# EAGLE design RasPiTimePowerSWv.1.5 (EAGLE 8.2.2)
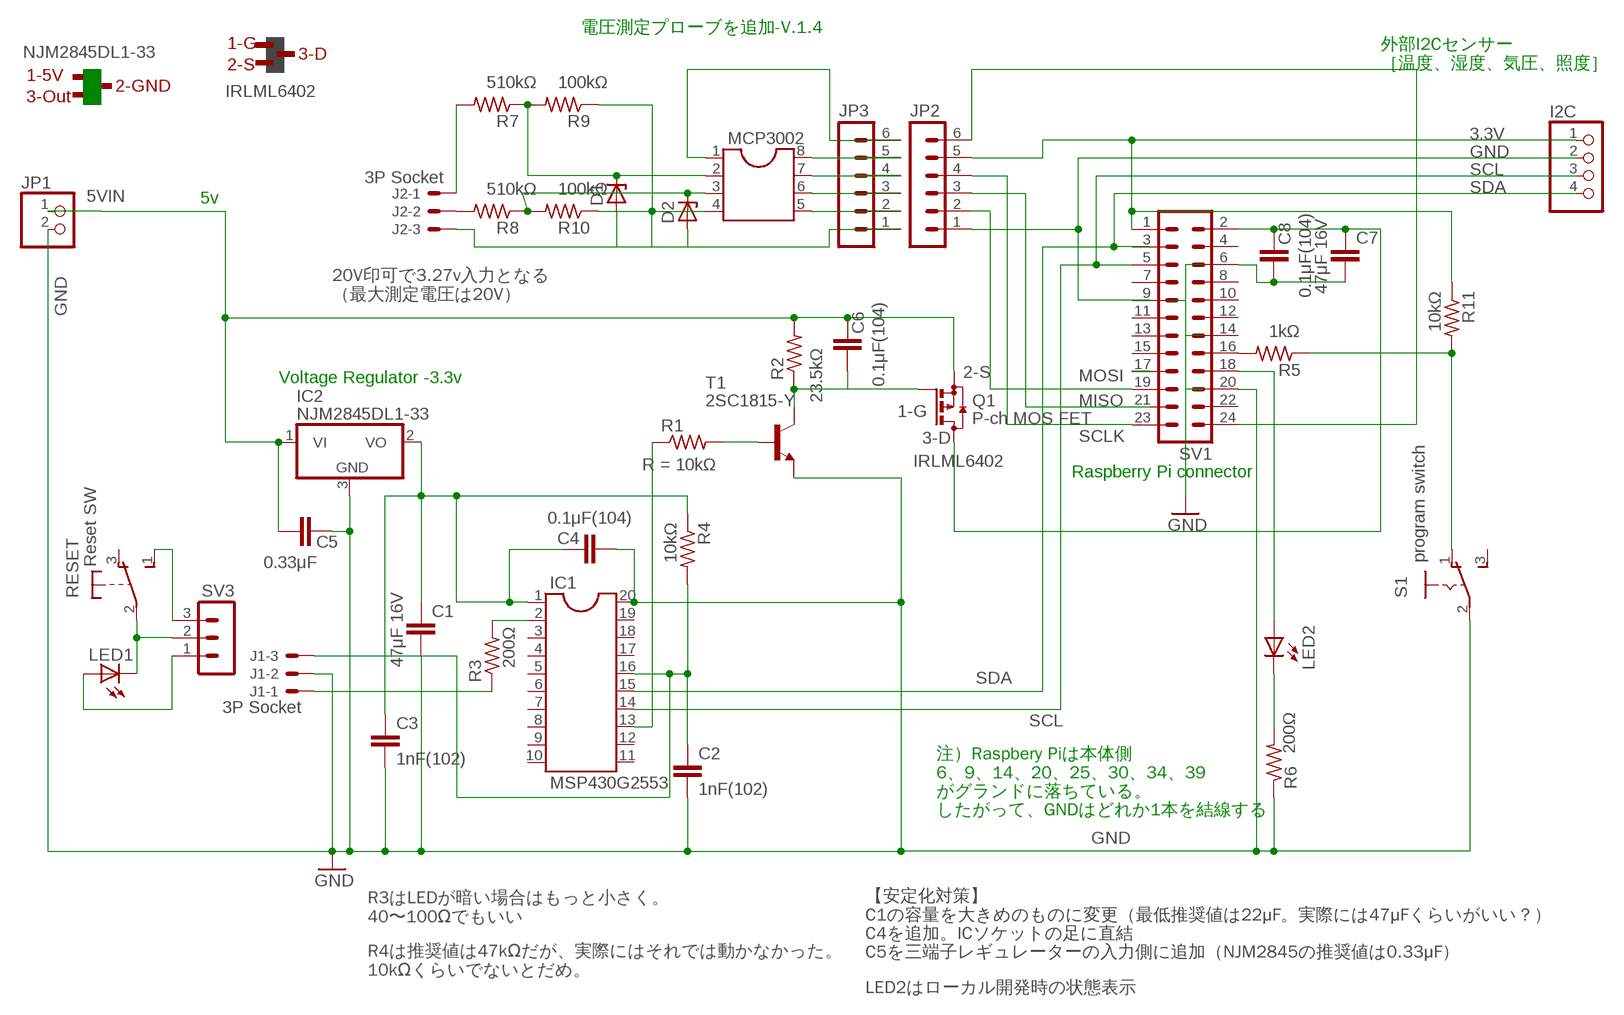
[diagram p0: schematic, sheet 1]

## Parts
C1  47μF 16V  C-EU075-042X103  [C075-042X103]
C2  1nF(102)  C-EU025-024X044  [C025-024X044]
C3  1nF(102)  C-EU025-024X044  [C025-024X044]
C4  0.1μF(104)  C-EU025-024X044  [C025-024X044]
C5  0.33μF  C-EU025-024X044  [C025-024X044]
C6  0.1μF(104)  C-EU025-024X044  [C025-024X044]
C7  47μF 16V  C-EU075-042X103  [C075-042X103]
C8  0.1μF(104)  C-EU025-024X044  [C025-024X044]
D1  ZENER-DIODEDO34-7  [DO34Z7]
D2  ZENER-DIODEDO34-7  [DO34Z7]
I2C  PINHD-1X4  [1X04]
IC1  MSP430G2553  DIL20S  [SOCKET-20]
IC2  NJM2845DL1-33  7818DT  [TO252]
J1  3P Socket  22-27-2031-03  [6410-03]
J2  3P Socket  22-27-2031-03  [6410-03]
JP1  PINHD-1X2  [1X02]
JP2  MA06-1  [MA06-1]
JP3  MA06-1  [MA06-1]
LED1  TLLG4400  [LED3MM]
LED2  TLLG4400  [LED3MM]
MCP3002  DIL8  [DIL08]
Q1  P-ch MOS FET  BSS84  [SOT23]
R1  R-US_MELF0102W  [MINI_MELF-0102W]
R2  R-US_MELF0102W  [MINI_MELF-0102W]
R3  R-US_MELF0102W  [MINI_MELF-0102W]
R4  10kΩ  R-US_MELF0102W  [MINI_MELF-0102W]
R5  R-US_MELF0102W  [MINI_MELF-0102W]
R6  R-US_MELF0102W  [MINI_MELF-0102W]
R7  R-US_MELF0102W  [MINI_MELF-0102W]
R8  R-US_MELF0102W  [MINI_MELF-0102W]
R9  R-US_MELF0102W  [MINI_MELF-0102W]
R10  R-US_MELF0102W  [MINI_MELF-0102W]
R11  10kΩ  R-US_MELF0102W  [MINI_MELF-0102W]
RESET  Reset SW  9450-1  [9450-1]
S1  program switch  255SB  [255SB]
SV1  MA12-2  [MA12-2]
SV3  MA03-1  [MA03-1]
T1  2SC1815-Y  2SC1815  [TO92-ECB]

## Nets
3.3V: C1.1 C3.1 C4.1 I2C.1 IC1.1 IC2.2(VO) JP2.5 R4.1 R11.1 SV1.1
5V: C7.1 C8.1 Q1.3(D) SV1.2
5VIN: C5.2 C6.1 IC2.1(VI) JP1.1 Q1.2(S) R2.2
GND: C1.2 C2.2 C3.2 C4.2 C5.1 I2C.2 IC1.20 IC2.3(GND) J1.2 JP1.2 JP2.1 R6.1 S1.2(P) SV1.9 SV1.20 T1.E
MISO: JP2.3 SV1.21
MOSI: JP2.2 SV1.19
N$1: R1.2 T1.B
N$2: IC1.13 R1.1
N$3: R5.2 SV1.16
N$4: IC1.2 R3.2
N$5: R5.1 R11.2 S1.1(O)
N$6: C6.2 Q1.1(G) R2.1 T1.C
N$7: J2.2 R8.2
N$8: C7.2 C8.2 SV1.6
N$9: LED2.A SV1.18
N$10: LED2.K(C) R6.2
N$11: RESET.1(S) SV3.3
N$12: LED1.A SV3.1
N$13: SV1.17
N$14: JP2.6 SV1.24
N$15: D1.C MCP3002.2 R7.1 R9.2
N$16: D2.C MCP3002.3 R8.1 R10.2
N$18: J2.1 R7.2
N$19: JP3.6 MCP3002.1
N$20: D1.A D2.A J2.3 JP3.1 MCP3002.4 R9.1 R10.1
N$21: JP3.2 MCP3002.5
N$22: JP3.3 MCP3002.6
N$23: JP3.4 MCP3002.7
N$24: JP3.5 MCP3002.8
N$25: LED1.K(C) RESET.2(P) SV3.2
N$26: J1.1 R3.1
RESET: C2.1 IC1.16 J1.3 R4.2
SCL: I2C.3 IC1.14 SV1.5
SCLK: JP2.4 SV1.23
SDA: I2C.4 IC1.15 SV1.3
Unconnected: IC1.3 IC1.4 IC1.5 IC1.6 IC1.7 IC1.8 IC1.9 IC1.10 IC1.11 IC1.12 IC1.17 IC1.18 IC1.19 RESET.3(O) S1.3(S) SV1.4 SV1.7 SV1.8 SV1.10 SV1.11 SV1.12 SV1.13 SV1.14 SV1.15 SV1.22

## Notes on the sheet
- 電圧測定プローブを追加-V.1.4
- 1-G
- NJM2845DL1-33 | 3-D
- 外部I2Cセンサー
  ［温度、湿度、気圧、照度］
- 2-S
- 1-5V
- 2-GND
- IRLML6402
- 3-Out
- 5v
- 20V印可で3.27v入力となる
  （最大測定電圧は20V）
- 2-S
- Voltage Regulator -3.3v
- 1-G
- 3-D
- IRLML6402
- Raspberry Pi connector
- 注）Raspbery Piは本体側
  6、9、14、20、25、30、34、39
  がグランドに落ちている。
  したがって、GNDはどれか1本を結線する
- R3はLEDが暗い場合はもっと小さく。
  40〜100Ωでもいい
- 【安定化対策】
  C1の容量を大きめのものに変更（最低推奨値は22μF。実際には47μFくらいがいい？）
  C4を追加。ICソケットの足に直結
  C5を三端子レギュレーターの入力側に追加（NJM2845の推奨値は0.33μF）
- R4は推奨値は47kΩだが、実際にはそれでは動かなかった。
  10kΩくらいでないとだめ。
- LED2はローカル開発時の状態表示

## Library data of the parts
C1-C8 = resistor:C-EU: CAPACITOR, European symbol
D1 D2 = diode:ZENER-DIODE: Z-Diode
I2C = pinhead:PINHD-1X4: PIN HEADER
IC1 = ic-package:DIL20: Dual In Line / Socket
IC2 = linear:78*: Positive VOLTAGE REGULATOR Source: http://cache.national.com/ds/LM/LM78L05.pdf http://www.fairchildsemi.com/ds/LM/LM7805.pdf
J1 J2 = con-molex:22-?-03: CONNECTOR wire to board 2.54 mm (.1 inch) pitch header; OC_FARNELL: unknown; OC_NEWARK: unknown
JP1 = pinhead:PINHD-1X2: PIN HEADER
JP2 JP3 = con-lstb:MA06-1: PIN HEADER; OC_FARNELL: unknown; OC_NEWARK: unknown
LED1 LED2 = led:TLLG4400: Low Current (2mA) LED 3 mm Tinted Diffused Package color GREEN Source: Data sheet <http://www.farnell.com/datasheets/391098.pdf>; MF: VISHAY SEMICONDUCTOR; OC_FARNELL: 1612435
MCP3002 = ic-package:DIL8: Dual In Line / Socket
Q1 = transistor-small-signal:BSS84: P-CHANNEL MOS FET
R1 = resistor:R-US_: RESISTOR, American symbol; R: 10kΩ
R2 = resistor:R-US_: RESISTOR, American symbol; 1K: 23.5kΩ
R3 R6 = resistor:R-US_: RESISTOR, American symbol; R: 200Ω
R4 R11 = resistor:R-US_: RESISTOR, American symbol
R5 = resistor:R-US_: RESISTOR, American symbol; 1K: 1kΩ
R7 R8 = resistor:R-US_: RESISTOR, American symbol; 1K: 510kΩ
R9 R10 = resistor:R-US_: RESISTOR, American symbol; 1K: 100kΩ
RESET = switch-misc:9450-1: MARQUARDT SWITCH
S1 = switch:255SB: SLIDING SWITCH Distributor Buerklin, 11G810
SV1 = con-lstb:MA12-2: PIN HEADER; OC_FARNELL: unknown; OC_NEWARK: unknown
SV3 = con-lstb:MA03-1: PIN HEADER; OC_FARNELL: unknown; OC_NEWARK: unknown
T1 = transistor:2SC1815: NPN EPITAXIAL TRANSISTOR Source: TOSHIBA .. 2SC1815 1.pdf

## Board
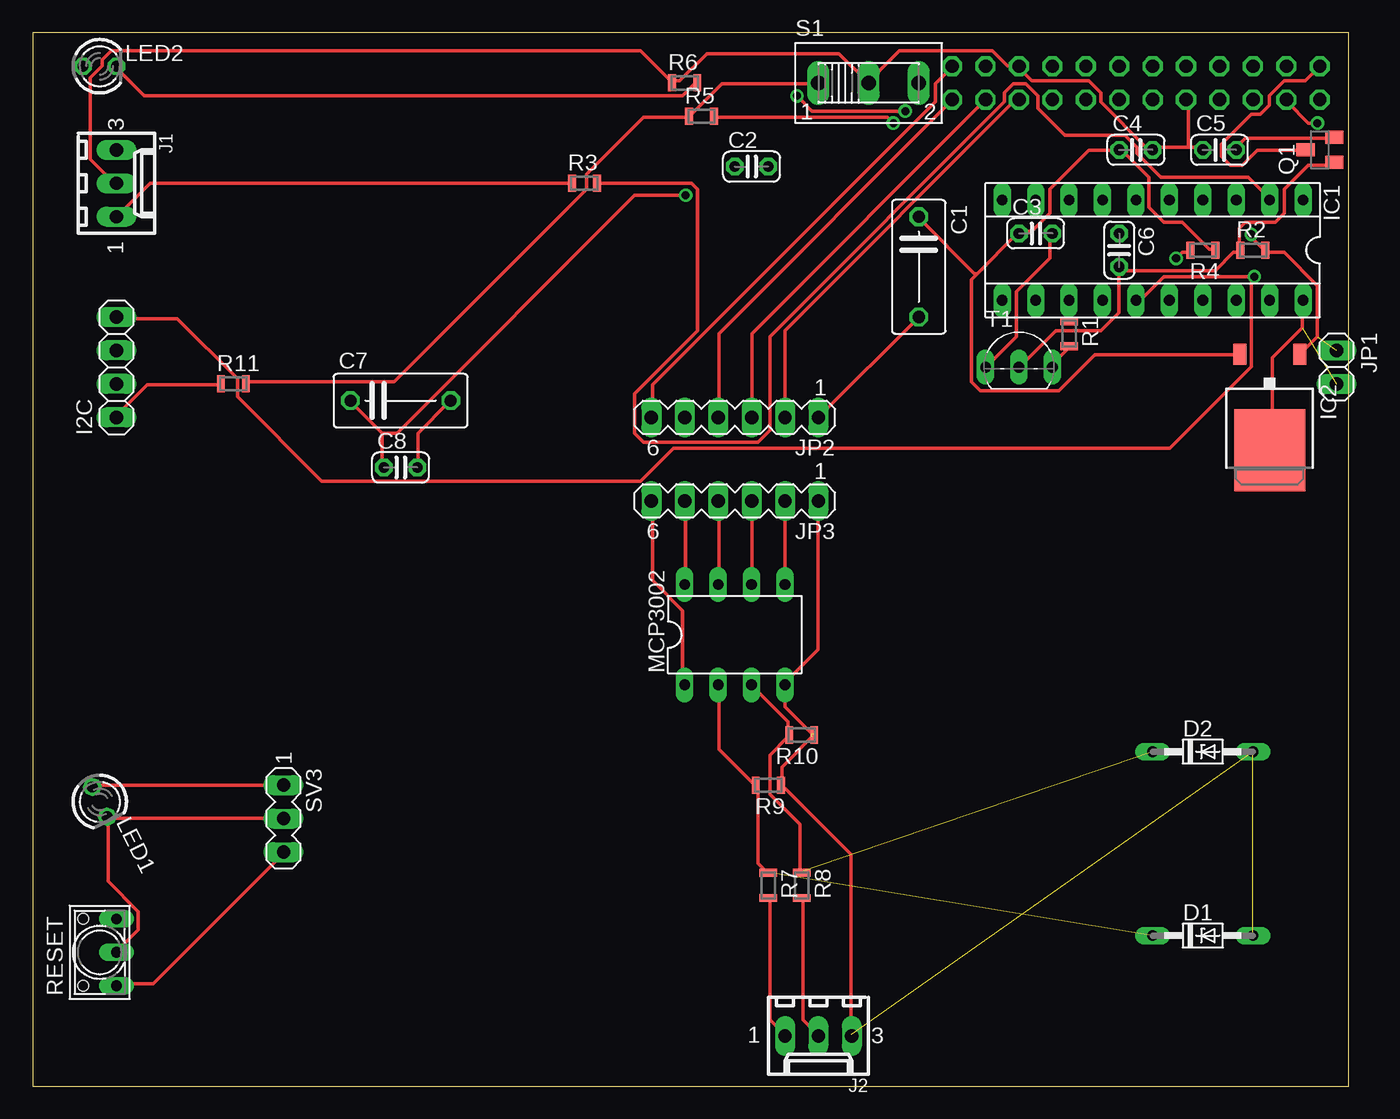
[diagram p1: board, top side]
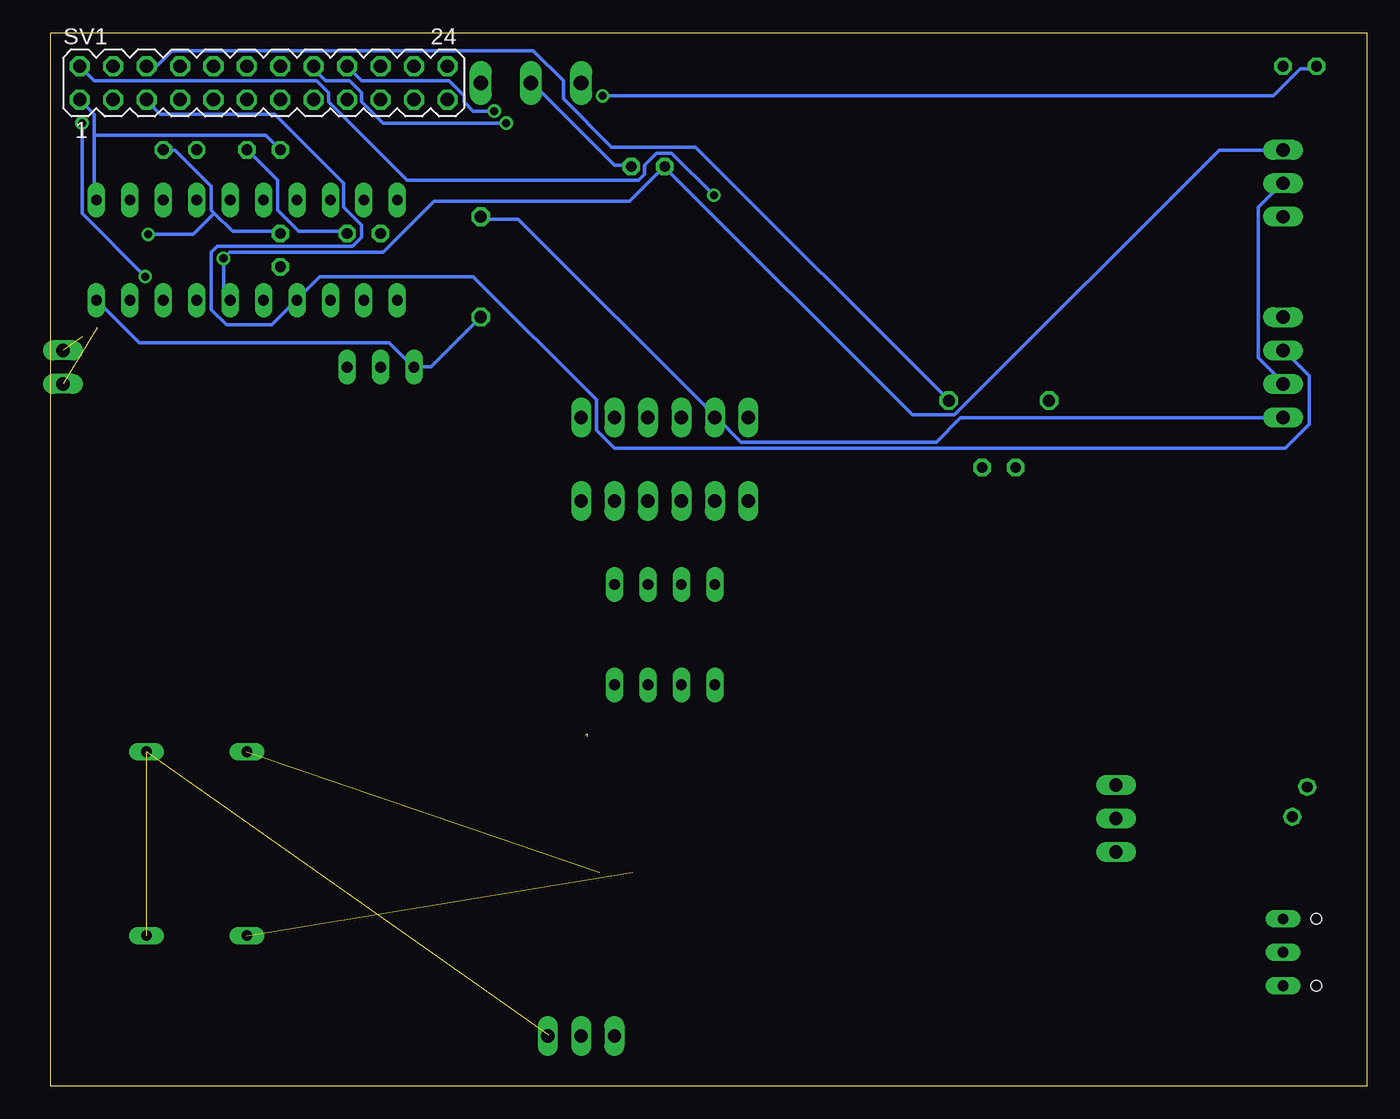
[diagram p2: board, bottom side, seen from below]

Size 100 x 80 mm. Coordinates in mm from the lower left corner, seen from the top.
Outline: 0,0 100,0 100,80 0,80 0,0
Copper layers (1*16): Top 0.035mm / dielectric 1.5mm / Bottom 0.035mm
Design rules "default": minimum track width 10mil, minimum drill 24mil, track to track 8mil, track to pad 8mil, pad to pad 8mil, via to via 8mil, smd to smd 8mil, copper to edge 40mil, drill to drill 8mil, minimum pad ring 10mil, minimum via ring 8mil, stop-mask expansion 4mil, vias tented up to drill 0mil, thermal gap 10mil

### Footprints (pad centres in the part's own frame; a part is rotated, then mirrored left to right if it is on the bottom)
C075-042X103 = drill 0.914 octagon: 1 -3.81,0; 2 3.81,0
C025-024X044 = drill 0.813 octagon: 1 -1.27,0; 2 1.27,0
DO34Z7 = drill 0.813 long: A 3.81,0; C -3.81,0
1X04 = drill 1.016 long: 1 -3.81,0; 2 -1.27,0; 3 1.27,0; 4 3.81,0
SOCKET-20 = drill 0.813 long: 1 -11.43,-3.81; 2 -8.89,-3.81; 3 -6.35,-3.81; 4 -3.81,-3.81; 5 -1.27,-3.81; 6 1.27,-3.81; 7 3.81,-3.81; 8 6.35,-3.81; 9 8.89,-3.81; 10 11.43,-3.81; 11 11.43,3.81; 12 8.89,3.81; 13 6.35,3.81; 14 3.81,3.81; 15 1.27,3.81; 16 -1.27,3.81; 17 -3.81,3.81; 18 -6.35,3.81; 19 -8.89,3.81; 20 -11.43,3.81
TO252 = smd 1 x 1.6: 1 -2.28,-4.8; 2 2.28,-4.8 | smd 5.4 x 6.2: 3 0,2.5
6410-03 = drill 1.016 long: 1 2.54,0; 2 0,0; 3 -2.54,0
1X02 = drill 1.016 long: 1 -1.27,0; 2 1.27,0
MA06-1 = drill 1.016 long: 1 -6.35,0; 2 -3.81,0; 3 -1.27,0; 4 1.27,0; 5 3.81,0; 6 6.35,0
LED3MM = drill 0.813 octagon: A -1.27,0; K 1.27,0
DIL08 = drill 0.813 long: 1 -3.81,-3.81; 2 -1.27,-3.81; 3 1.27,-3.81; 4 3.81,-3.81; 5 3.81,3.81; 6 1.27,3.81; 7 -1.27,3.81; 8 -3.81,3.81
SOT23 = smd 1 x 1.4: 1 -0.95,-1.1; 2 0.95,-1.1; 3 0,1.1
MINI_MELF-0102W = smd 0.6 x 1.3: 1 -0.95,0; 2 0.95,0
9450-1 = drill 0.813 long: 1 -2.54,-1.27; 2 0,-1.27; 3 2.54,-1.27 | hole 0.813: 2.54,1.27; -2.54,1.27
255SB = drill 1.118 long: 1 -3.81,0; 2 0,0; 3 3.81,0
MA12-2 = drill 1.016 octagon: 1 -13.97,-1.27; 2 -13.97,1.27; 3 -11.43,-1.27; 4 -11.43,1.27; 5 -8.89,-1.27; 6 -8.89,1.27; 7 -6.35,-1.27; 8 -6.35,1.27; 9 -3.81,-1.27; 10 -3.81,1.27; 11 -1.27,-1.27; 12 -1.27,1.27; 13 1.27,-1.27; 14 1.27,1.27; 15 3.81,-1.27; 16 3.81,1.27; 17 6.35,-1.27; 18 6.35,1.27; 19 8.89,-1.27; 20 8.89,1.27; 21 11.43,-1.27; 22 11.43,1.27; 23 13.97,-1.27; 24 13.97,1.27
MA03-1 = drill 1.016 long: 1 -2.54,0; 2 0,0; 3 2.54,0
TO92-ECB = drill 0.813 long: B 2.54,0; C 0,0; E -2.54,0

### Placement (x,y rotation side)
C1  67.31,62.23 270 top
C2  54.61,69.85 0 top
C3  76.2,64.77 0 top
C4  83.82,71.12 0 top
C5  90.17,71.12 0 top
C6  82.55,63.5 270 top
C7  27.94,52.07 0 top
C8  27.94,46.99 0 top
D1  88.9,11.43 0 top
D2  88.9,25.4 0 top
I2C  6.35,54.61 90 top
IC1  85.09,63.5 180 top
IC2  93.98,50.8 180 top
J1  6.35,68.58 270 top
J2  59.69,3.81 180 top
JP1  99.06,54.61 270 top
JP2  53.34,50.8 180 top
JP3  53.34,44.45 180 top
LED1  5.08,21.59 296.5 top
LED2  5.08,77.47 0 top
MCP3002  53.34,34.29 0 top
Q1  97.79,71.12 90 top
R1  78.74,57.15 270 top
R2  92.71,63.5 0 top
R3  41.91,68.58 0 top
R4  88.9,63.5 180 top
R5  50.8,73.66 0 top
R6  49.53,76.2 0 top
R7  55.88,15.24 270 top
R8  58.42,15.24 270 top
R9  55.88,22.86 180 top
R10  58.42,26.67 180 top
R11  15.24,53.34 0 top
RESET  5.08,10.16 90 top
S1  63.5,76.2 0 top
SV1  83.82,76.2 0 bottom
SV3  19.05,20.32 270 top
T1  74.93,54.61 0 top

### Tracks (layer width: path | path; a pad name or v marks a point on that pad's centre or on a via)
3.3V
  Top 0.254: R4.1 89.84,63.55 89.38,63.55 87.33,65.61 85.95,65.61 84.81,66.75 84.81,69.04 82.75,71.09 C4.1 82.53,71.09 80.24,71.09 77.27,68.12 77.27,66.29 75.89,64.92 74.98,64.92 C3.1 74.75,64.69 71.78,61.72 | R11.1 14.17,53.26 8.69,53.26 6.4,50.98 I2C.1 | 71.78,61.72 71.32,61.27 71.32,53.49 72.01,52.81 77.95,52.81 80.7,55.55 91.67,55.55 IC2.2 | 71.78,61.72 71.55,61.72 67.44,65.84 C1.1
  Bottom 0.254: 96.7,72.24 96.7,73.84 SV1.1 | 96.7,72.24 96.7,67.44 IC1.1 | 96.7,72.24 83.67,72.24 C4.1 | C1.1 67.21,65.84 64.47,65.84 49.61,50.98 JP2.5 49.38,50.75 47.55,48.92 32.69,48.92 30.86,50.75 6.4,50.75 I2C.1
5V  (via drill 0.61)
  Top 0.254: 26.52,49.61 26.52,47.09 C8.1 | 26.52,49.61 24.23,51.89 C7.1 | Q1.3 96.47,71.09 93.04,71.09 91.9,69.95 90.98,69.95 90.3,70.64 90.3,71.55 92.58,73.84 93.27,73.84 93.95,74.52 93.95,75.21 95.1,76.35 96.7,76.35 97.61,77.27 SV1.2 | 26.52,49.61 27.66,49.61 45.72,67.67 v49.61,67.67
  Bottom 0.254: v49.61,67.67 52.81,70.87 53.95,70.87 54.86,69.95 54.86,69.27 55.32,68.81 72.92,68.81 78.87,74.75 78.87,75.44 79.78,76.35 96.7,76.35 97.61,77.27 SV1.2
5VIN  (via drill 0.61)  (1 unrouted)
  Top 0.254: IC2.1 96.47,55.78 97.61,56.92 97.61,60.81 95.1,63.32 93.73,63.32 R2.2 93.5,63.55 92.58,64.47 v92.58,64.69 | Q1.2 98.75,72.01 92.13,72.01 91.44,71.32 C5.2
  Bottom 0.254: 87.55,66.29 87.78,66.52 87.78,68.35 90.53,71.09 91.44,71.09 C5.2 | 87.55,66.29 86.18,64.92 82.75,64.92 C6.1 | v92.58,64.69 89.15,64.69 87.55,66.29
GND  (1 unrouted)
  Top 0.254: 87.78,71.32 85.27,71.32 C4.2 85.04,71.32 84.58,71.32 81.15,74.75 81.15,75.44 80.24,76.35 75.89,76.35 74.98,77.27 SV1.20 74.75,77.5 74.07,77.5 72.92,78.64 65.84,78.64 63.55,76.35 S1.2 63.32,76.35 61.27,78.41 51.21,78.41 49.15,76.35 48.69,76.35 R6.1 48.46,76.35 46.18,78.64 5.94,78.64 5.26,77.95 5.26,77.5 4.34,76.58 4.34,70.41 6.17,68.58 J1.2 | 87.78,71.32 88.7,71.32 C5.1 | 87.78,71.32 87.78,74.75 SV1.9 | IC1.20 96.47,59.66 96.47,57.61 94.18,55.32 94.18,48.46 IC2.3 | JP2.1 59.89,50.98 67.21,58.29 C1.2 | C3.2 77.27,64.69 77.27,62.87 74.75,60.35 74.75,56.92 72.47,54.63 T1.E
  Bottom 0.254: C3.2 77.5,64.92 81.15,64.92 82.75,66.52 82.75,68.81 85.04,71.09 C4.2 | C1.2 71.09,54.63 72.24,54.63 T1.E 72.47,54.63 74.3,56.46 93.27,56.46 96.47,59.66 IC1.20 | I2C.2 6.4,53.49 8.23,55.32 8.23,66.75 6.4,68.58 J1.2 | C2.2 56.01,69.95 57.15,69.95 63.32,76.12 S1.2
MISO
  Top 0.254: JP2.3 54.63,50.98 54.63,57.15 72.24,74.75 SV1.21
MOSI
  Top 0.254: JP2.2 57.15,57.38 74.75,74.98 SV1.19
N$1
  Top 0.254: R1.2 78.64,56.01 77.27,54.63 T1.B
N$2
  Top 0.254: R1.1 78.87,58.29 78.87,59.66 IC1.13
N$3  (via drill 0.61)
  Top 0.254: v65.38,73.15 64.92,73.61 51.89,73.61 R5.2
  Bottom 0.254: v65.38,73.15 74.75,73.15 76.35,74.75 76.35,75.44 77.27,76.35 79.1,76.35 80.01,77.27 SV1.16
N$4
  Top 0.254: R3.2 50.06,68.58 50.52,68.12 50.52,57.38 45.72,52.58 45.72,49.61 46.41,48.92 55.09,48.92 56.01,49.84 56.01,56.92 73.84,74.75 73.84,75.44 74.52,76.12 75.44,76.12 76.35,75.21 76.35,74.3 78.41,72.24 82.98,72.24 83.9,71.32 83.9,70.87 85.72,69.04 92.35,69.04 93.95,67.44 IC1.2
N$5
  Top 0.254: R11.2 16.23,53.49 27.43,53.49 42.06,68.12 42.06,69.27 46.41,73.61 49.84,73.61 R5.1 50.06,73.84 52.35,76.12 59.66,76.12 S1.1
N$6
  Top 0.254: Q1.1 98.75,69.95 96.93,69.95 95.1,68.12 95.1,66.29 94.41,65.61 92.13,65.61 91.67,65.15 91.67,63.55 R2.1 91.67,63.32 91.21,63.32 89.84,61.95 82.98,61.95 82.75,62.18 C6.2 82.53,62.18 82.53,58.75 81.15,57.38 77.72,57.38 74.98,54.63 T1.C
N$7
  Top 0.254: R8.2 58.52,14.17 58.52,5.03 59.66,3.89 J2.2
N$8
  Top 0.254: C8.2 29.26,47.09 29.26,49.61 31.55,51.89 C7.2
  Bottom 0.254: SV1.6 92.58,77.5 91.9,77.5 90.75,78.64 63.32,78.64 61.04,76.35 61.04,74.98 57.38,71.32 50.98,71.32 31.77,52.12 C7.2
N$9  (via drill 0.61)
  Top 0.254: v58.06,75.21 59.21,74.07 v66.29,74.07
  Bottom 0.254: v58.06,75.21 7.09,75.21 5.03,77.27 3.89,77.27 LED2.A | v66.29,74.07 67.89,74.07 68.58,74.75 68.58,75.21 69.72,76.35 76.35,76.35 SV1.18
N$10
  Top 0.254: R6.2 50.29,76.12 49.38,75.21 8.46,75.21 6.4,77.27 LED2.K
N$11
  Top 0.254: RESET.1 6.4,7.77 9.14,7.77 18.97,17.6 SV3.3
N$12
  Top 0.254: SV3.1 4.57,22.86 LED1.A
N$14
  Top 0.254: JP2.6 47.09,50.98 47.09,53.26 68.58,74.75 68.58,76.12 69.72,77.27 SV1.24
N$15  (1 unrouted)
  Top 0.254: R7.1 55.78,16.23 55.09,16.92 55.09,22.86 R9.2 54.86,22.86 52.12,25.6 52.12,30.4 MCP3002.2
N$16  (1 unrouted)
  Top 0.254: MCP3002.3 54.63,30.4 57.38,27.66 57.38,26.75 R10.2 57.38,26.52 56.01,25.15 56.01,22.17 58.29,19.89 58.29,16.23 R8.1
N$18
  Top 0.254: R7.2 56.01,14.17 56.01,5.03 57.15,3.89 J2.1
N$19
  Top 0.254: MCP3002.1 49.38,30.63 49.38,36.12 47.09,38.41 47.09,44.35 JP3.6
N$20  (4 unrouted)
  Top 0.254: 56.92,22.86 56.92,24.23 59.21,26.52 | 59.21,26.75 57.15,28.8 MCP3002.4 57.15,30.63 59.66,33.15 59.66,44.35 JP3.1 | 56.92,22.86 62.18,17.6 62.18,3.89 J2.3 | 56.92,22.86 R9.1
N$21
  Top 0.254: JP3.2 MCP3002.5
N$22
  Top 0.254: MCP3002.6 54.63,38.18 54.63,44.35 JP3.3
N$23
  Top 0.254: MCP3002.7 52.12,38.18 52.12,44.35 JP3.4
N$24
  Top 0.254: MCP3002.8 49.61,38.18 49.61,44.35 JP3.5
N$25
  Top 0.254: 5.71,20.34 5.71,15.54 8,13.26 8,11.89 6.4,10.29 RESET.2 | 5.71,20.34 18.97,20.34 SV3.2 | 5.71,20.34 LED1.K
N$26
  Top 0.254: R3.1 8.91,68.58 6.4,66.06 J1.1
RESET  (via drill 0.61)
  Top 0.254: v86.87,62.87 87.33,63.32 87.78,63.32 R4.2
  Bottom 0.254: IC1.16 86.41,59.89 86.87,60.35 v86.87,62.87 86.41,63.32 74.75,63.32 70.87,67.21 56.01,67.21 53.49,69.72 C2.1 53.26,69.72 34.52,50.98 31.32,50.98 11.2,71.09 6.4,71.09 J1.3
SCL
  Bottom 0.254: SV1.5 92.58,74.75 91.67,73.84 82.98,73.84 77.72,68.58 77.72,66.75 76.35,65.38 76.35,64.47 77.04,63.78 87.33,63.78 87.78,63.32 87.78,58.98 86.64,57.84 83.21,57.84 81.38,59.66 IC1.14 81.15,59.89 79.55,61.49 67.89,61.49 58.52,52.12 58.52,49.84 57.15,48.46 6.17,48.46 4.34,50.29 4.34,53.95 6.17,55.78 I2C.3
SCLK
  Top 0.254: JP2.4 52.12,50.98 52.12,57.15 69.72,74.75 SV1.23
SDA  (via drill 0.61)
  Top 0.254: 92.58,61.49 85.95,61.49 84.35,59.89 83.9,59.89 IC1.15 | v97.61,73.15 96.93,73.15 95.33,74.75 SV1.3 | 92.58,61.49 92.58,54.63 86.41,48.46 48.69,48.46 46.18,45.95 21.95,45.95 15.54,52.35 15.54,53.72 10.97,58.29 6.4,58.29 I2C.4 | 92.58,61.49 v92.81,61.49
  Bottom 0.254: v92.81,61.49 97.61,66.29 v97.61,73.15